# Altium schematic sheet power.SchDoc
size A4; SheetNumber: 2; SheetTotal: 3
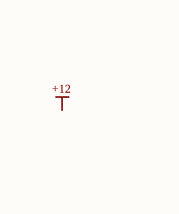
[diagram p0: power.SchDoc, left]
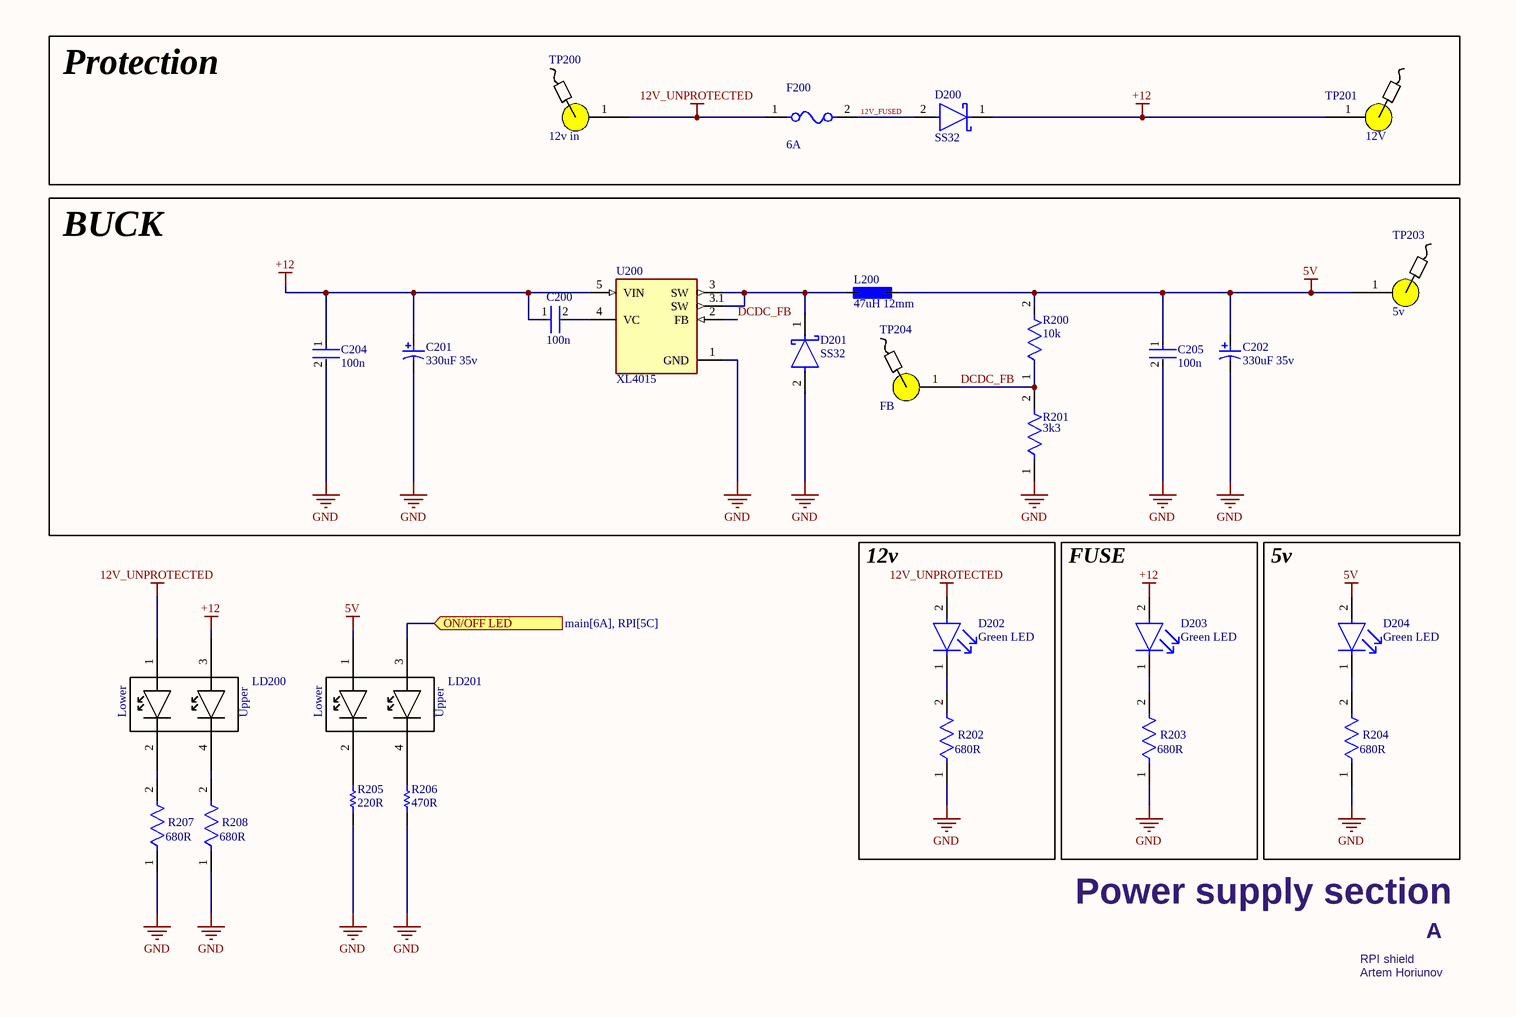
[diagram p1: power.SchDoc, right]

## Parts
C200  100n  [FP-C0603C-CF-MFG]
C201  330uF 35v  [PNSC-EEE-FK1V331P_L]
C202  330uF 35v  [PNSC-EEE-FK1V331P_L]
C204  100n  [FP-C0603C-CF-MFG]
C205  100n  [FP-C0603C-CF-MFG]
D200  SS32  [FP-403AG-MFG]
D201  SS32  [FP-403AG-MFG]
D202  Green LED  [FP-HSME-C191-MFG]
D203  Green LED  [FP-HSME-C191-MFG]
D204  Green LED  [FP-HSME-C191-MFG]
F200  6A  [FP-0466-MFG]
L200  47uH 12mm  [DE1207]
LD200  (no value)  [LED_HOLDER]
LD201  (no value)  [LED_HOLDER]
R200  10k  [FP-RC0603-0_55-IPC_C]
R201  3k3  [FP-RC0603-0_55-MFG]
R202  680R  [FP-CRCW0603-e3-MFG]
R203  680R  [FP-CRCW0603-e3-MFG]
R204  680R  [FP-CRCW0603-e3-MFG]
R205  220R  [RESC1608X55X25ML10T15]
R206  470R  [RESC1608X55X25LL10T15]
R207  680R  [FP-CRCW0603-e3-MFG]
R208  680R  [FP-CRCW0603-e3-MFG]
TP200  12v in  [TestPoint]  (no BOM)
TP201  12V  [TestPoint]  (no BOM)
TP203  5v  [TestPoint]  (no BOM)
TP204  FB  [TestPoint]  (no BOM)
U200  XL4015  [CONV_XL4015]

## Blocks framed on the sheet
Protection: D200 F200 TP200 TP201
BUCK: C200-C202 C204 C205 D201 L200 R200 R201 TP203 TP204 U200
12v: D202 R202
FUSE: D203 R203
5v: D204 R204

## Ports
ON/OFF LED (in, see main[6A], RPI[5C])

## Nets
5V: C202.1 C205.1 D204.2(A) L200.2 LD201.1 R200.2 TP203.1
12V_UNPROTECTED: D202.2(A) F200.1 LD200.1 TP200.1
+12: C200.1 C201.1 C204.1 D200.1(C) D203.2(A) LD200.3 TP201.1 U200.5(VIN)
GND: C201.2 C202.2 C204.2 C205.2 D201.2(A) R201.1 R202.1 R203.1 R204.1 R205.1 R206.1 R207.1 R208.1 U200.1(GND)
12V_FUSED: D200.2(A) F200.2
DCDC_FB: R200.1 R201.2 TP204.1 U200.2(FB)
ON/OFF LED: LD201.3 ; port ON/OFF LED
NetC200_2: C200.2 U200.4(VC)
NetD201_1: D201.1(C) L200.1 U200.3(SW) U200.3.1(SW)
NetD202_1: D202.1(C) R202.2
NetD203_1: D203.1(C) R203.2
NetD204_1: D204.1(C) R204.2
NetLD200_2: LD200.2 R207.2
NetLD200_4: LD200.4 R208.2
NetLD201_2: LD201.2 R205.2
NetLD201_4: LD201.4 R206.2

## Notes on the sheet
- Power supply section
- RPI shield
- A
- Artem Horiunov
- Labels drawn without touching a wire or pin: +12
- (in symbol DoubleStack_Side_Led_3mm) Lower; Upper

## Library data of the parts
C200 C204 C205 = CMP-2006-03061-2: CAP CER 0.1UF 50V X7R 0603; Manufacturer: KEMET; Manufacturer Part Number: C0603C104K5RACTU; Tolerance: 0.1; Temperature Coefficient: 30ppm/°C; Material: Ceramic; Automotive Grade: Grade 1; Value: 0.10 μF; Temperature: -55°C to +125°C; RoHS: TRUE; Temperature Range High: +125°C; Lead Free: Yes; Octopart: https://octopart.com/c0603c104k5ractu-kemet-139244; Digikey Description: CAP CER 0.1UF 50V X7R 0603; Category: Cap; Package: C0603C-CF; ComponentLink2Description: Datasheet; Temperature Range Low: -55°C; Device Class L1: Passive Components; Voltage Rating: 50 V; Automotive: Yes; Device Class L3: Ceramic Capacitors; ComponentLink2URL: https://api.kemet.com/component-edge/download/datasheet/C0603C100J5GACAUTO.pdf; Capacitance: 0.10 μF; Device Class L2: Capacitors; Temperature Characteristic: X7R; Height: 0.87mm
C201 C202 = CMP-2000-06212-1: Aluminum Electrolytic Capacitor, 330 uF, 35 V, -55 to 105 degC, 2-Pin CAPAE, RoHS, Tape and Reel; Manufacturer: Panasonic; Capacitance: 330µF; Type: Can; Impedance: 0.08O; Ripple Current: 850mA; Lifetime@Temperature: 2000Hrs@105°C; Datasheet Version: 07/2008; Manufacturer URL: http://www.panasonic.com/; Package Description: 2-Pin Capacitor Aluminum Electrolytic, Body 10.3 x 10.3 mm, Height 10.5 mm; Case Size/Dimension: Ø10x10.2mm; Datasheet URL: https://datasheet.ciiva.com/29313/443481-da-01-en-smd-elko-vfk-g-330-uf-35v-29313592.pdf; Series: FK; Mounting Technology: SurfaceMount; Package Reference: EEE-FK1V331P; Operating Temp-Max: 105°C; Operating Temp Range: -55to+105°C; Rated Voltage: 35V
D200 D201 = CMP-00278-84331622-1: SS32 Rectifier Diode, Schottky, 1 Phase, 1 Element, 3A, 20V V(RRM), Silicon, DO-214AB; Manufacturer Lifecycle Status: ACTIVE; Forward Voltage: 500mV; Max Forward Surge Current (Ifsm): 100A; Max Reverse Leakage Current: 500µA; Max Junction Temperature (Tj): 150°C; Element Configuration: Single; Max Power Dissipation: 2.27W; Polarity: Standard; Number of Elements: 1; RoHS: Compliant; Forward Current: 3A; Height: 2.65mm; Max Reverse Voltage (DC): 20V; NexarPartId: 84331622; Max Repetitive Reverse Voltage (Vrrm): 20V; Schedule B: 8541100080, 8541100080; Lead Free: Lead Free; Current Rating: 3A; Radiation Hardening: No; Mount: Surface Mount; Max Operating Temperature: 150°C; Average Rectified Current: 3A; Number of Pins: 2; Output Current: 3A; Packaging: Cut Tape; Min Operating Temperature: -55°C; Max Surge Current: 100A; REACH SVHC: No SVHC; Case/Package: SMC; Weight: 300mg; Lifecycle Status: Production; Peak Reverse Current: 500µA; Number of Terminals: 2; Width: 6.25mm; Length: 7.15mm; Voltage Rating (DC): 20V; Peak Non-Repetitive Surge Current: 100A
D202-D204 = CMP-18399-000013-1: LED GREEN DIFFUSED 0603 SMD; Manufacturer: Broadcom; Manufacturer Part Number: HSME-C191; Forward Current: 20mA; Reverse Voltage: 5V; Forward Voltage: 2.1V; Viewing Angle: 170°; Wavelength: 572nm; Power Dissipation: 52mW; Max Junction Temp: +95°C; Luminous Intensity: 50mcd; Led Orientation: Top View; Peak Emmision Wavelength: 570nm; Package: 0; Category: Diode; ComponentLink2URL: https://docs.broadcom.com/docs/AV02-0976EN; ComponentLink2Description: Datasheet; Device Class L2: LEDs; Digikey Description: LED GREEN DIFFUSED 0603 SMD; Height: 0.7mm; RoHS: TRUE; Colour: Green; Lead Free: Yes; Device Class L1: Optoelectronics; Device Class L3: unset; Temperature Range High: +85°C; Automotive: No; Temperature: -40°C to +85°C; Octopart: https://octopart.com/hsme-c191-broadcom-71131261; Mouser Description: Standard LEDs - SMD AlInGaP Green; Temperature Range Low: -40°C
F200 = CMP-08605-000093-1: Voltage Rating: 63V; Body Material: Thermoplastic; Fuse Type: Board Mount (Cartridge Style Excluded); Resistance: 220mR; Current Rating: 750mA; DC Cold Resistance: 111mR; Approvals: UL; Package Quantity: 5000; Radiation Hardening: No; Width: 0.06inch; Mount: Surface Mount; Case Code (Metric): 3216; Length: 3.18mm; Depth: 1.52mm; Series: 466; Voltage Rating (AC): 63V; Case Code (Imperial): 1206; Voltage Rating (DC): 63V; Min Operating Temperature: -55°C; Height: 0.023inch; Working Voltage: 63V; RoHS Compliant: Yes; Packaging: Tape and Reel; Number of Pins: 2; Lead Free: Lead Free; Case/Package: 1206; Max Operating Temperature: 90°C; Termination: SMD/SMT; Fuse Current: 750mA
L200 = DE1207-22: Inductor: wire; 22uH; 4.7A; 0.036Î©; SMD; 12x12x8mm; Â±20; MF: FerroCore; SnapEDA_Link: https://www.snapeda.com/parts/DE1207-22/FerroCore/view-part/?ref=snap; Package: None; Value: *; MP: DE1207-22; Check_prices: https://www.snapeda.com/parts/DE1207-22/FerroCore/view-part/?ref=eda
LD200 LD201 = DoubleStack_Side_Led_3mm
R200 = CMP-2100-03664-2: RES 10K OHM 1% 1/10W 0603; Voltage Rating: 75V; Voltage Rating (DC): 50V; Resistance: 10kR; Power Rating: 100mW; Temperature Coefficient: 100ppm/°C; Depth: 0.8mm; Termination: SMD/SMT; Resistor Type: Thick Film; Series: RC; Construction: Rectangular; Features: Moisture Resistant; Packaging: Tape and Reel; Min Operating Temperature: -55°C; Number of Terminations: 2; Lead Pitch: 0.3mm; RoHS Compliant: Yes; Case/Package: 0603; Resistance Tolerance: 1%; Military Standard: Not; Weight: 7.1E-05oz; Number of Pins: 2; Tolerance: 1%; Length: 1.6mm; Case Code (Imperial): 0603; Lead Free: Lead Free; Width: 0.8mm; Max Power Dissipation: 100mW; Height: 0.45mm; Max Operating Temperature: 155°C; Case Code (Metric): 1608; Size Code: 0603
R201 = CMP-1012-00567-3: NexarPartId: 40011875; Tolerance: 1%; Power Rating: 100mW; Temperature Coefficient: 100ppm/°C; Voltage Rating (DC): 50V; Resistance: 3.3kΩ; Military Standard: Not; Case/Package: 0603; Mount: Surface Mount; Lead Free: Lead Free; Packaging: Tape & Reel; Termination: SMD/SMT; Number of Terminations: 2; Composition: Thick Film; Length: 1.6mm; Max Power Dissipation: 100mW; Width: 800µm; Features: Moisture Resistant; Max Operating Temperature: 155°C; Depth: 800µm; Number of Pins: 2; REACH SVHC: No SVHC; Case Code (Imperial): 0603; Case Code (Metric): 0603; RoHS: Compliant; Voltage Rating (AC): 50V; Voltage Rating: 50V; Schedule B: 8533210045, 8533210045; Min Operating Temperature: -55°C; Height: 450µm
R202-R204 R207 R208 = CMP-2000-03529-2: RES Thick Film, 680Ω, 1%, 0.1W, 100ppm/°C, 0603; Voltage Rating (DC): 75V; Max Power Dissipation: 100mW; Radiation Hardening: No; Case Code (Imperial): 0603; Number of Pins: 2; Termination: SMD/SMT; Lead Free: Lead Free; Contact Plating: Tin; Case Code (Metric): 1608; Max Operating Temperature: 155°C; Tolerance: 1%; Military Standard: Not; Features: Automotive AEC-Q200; Power Rating: 100mW; Width: 0.85mm; Depth: 0.85mm; Resistance: 680R; Height: 0.45mm; Case/Package: 0603; Min Operating Temperature: -55°C; Length: 1.55mm; Voltage Rating: 75V; Composition: Thick Film; Working Voltage: 75V; Temperature Coefficient: 100ppm/°C; Packaging: Tape and Reel; Package Quantity: 10; Weight: 7.1E-05oz; Number of Terminations: 2
R205 = CMP-1659-00018-2: General Purpose Chip Resistors, 220 Ohm, +/- 1%, -55 to 155 degC, 0603 (1608 Metric), RoHS, Tape and Reel; RoHSCompliant: false; DatasheetVersion: Rev. 4, 04/2009; ComponentLink2Description: Datasheet; ComponentLink2URL: https://datasheet.ciiva.com/11808/0900766b80f96399-11808136.pdf; ComponentLink1URL: http://www.yageo.com/; ComponentLink1Description: Manufacturer URL; PackageReference: 0603; PackageDescription: 2-Pin Surface Mount Device, Body 1.6 x 0.8 mm
R206 = CMP-1659-00035-2: General Purpose Chip Resistor, 470 Ohm, +/- 1%, -55 to 155 degC, 0603 (1608 Metric), RoHS, Tape and Reel; Resistance: 470 Ohm; ComponentLink1Description: Manufacturer URL; Contact Plating: Gold; Width: 3.1 mm; Radiation Hardening: No; DatasheetVersion: Rev. 4, 04/2009; Length: 3 mm; PackageDescription: 2-Pin Surface Mount Device, Body 1.6 x 0.8 mm; ComponentLink1URL: http://www.yageo.com/; Min Operating Temperature: -40 degC; Mount: Surface Mount; Package Quantity: 2500; ComponentLink2URL: https://datasheet.ciiva.com/11808/0900766b80f96399-11808177.pdf; RoHSCompliant: true; Fastening Type: Snap; PackageReference: 0603; Max Operating Temperature: 90 degC; Height: 1.25 mm; Packaging: Tape and Reel; ComponentLink2Description: Datasheet; Contact Material: Brass
TP200 TP201 TP203 TP204 = TestPoint
U200 = XL4015: 5A 180KHz 36V Buck DC to DC Converter; Price: None; MP: XL4015; Value: *; Availability: Unavailable; Package: None